# Altium project QuadcopterDesign.PrjPcb (part 4 of 4)
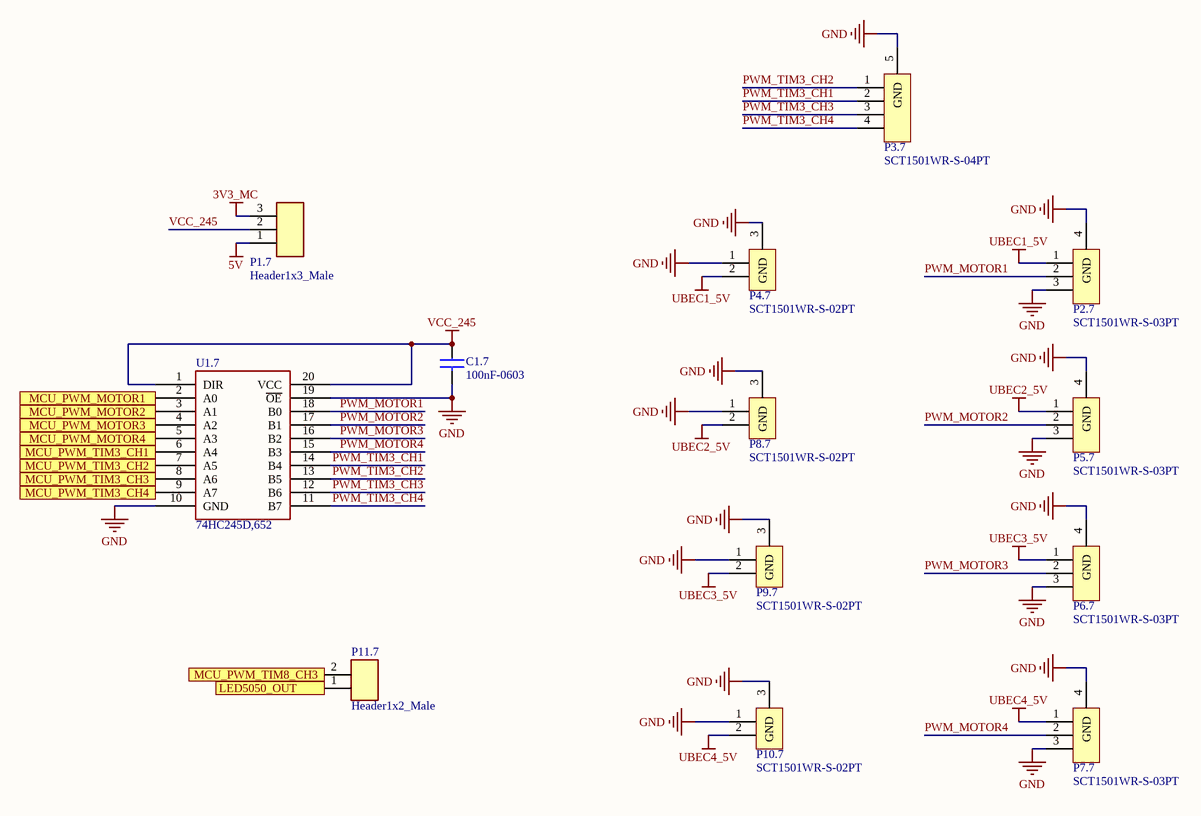
[diagram p7: [7] Motor_Control.SchDoc]

## Nets that join several sheets
3V3_MC: [1] PowerSupply (5 pins), [2] MicroController (17 pins), [7] Motor_Control (P1.7.3)
3V3_Sensor: [1] PowerSupply (C12.1.1 IC5.1.2 IC5.1.4), [3] Sensor (15 pins), [6] Radio Frequency (P4.6.1)
3V3_WIFI: [1] PowerSupply (C3.1.1 IC1.1.2 IC1.1.4), [4] Wifi_ESP32_Antenna (8 pins)
5V: [1] PowerSupply (9 pins), [2] MicroController (B1.2.1), [5] Peripheral_Module (11 pins), [6] Radio Frequency (5 pins), [7] Motor_Control (P1.7.1)
5V_WIFI: [1] PowerSupply (C6.1.1 IC1.1.3 P2.1.1), [4] Wifi_ESP32_Antenna (C4.4.1 C5.4.1 D3.4.1 U2.4.8)
GND: [1] PowerSupply (31 pins), [2] MicroController (27 pins), [3] Sensor (30 pins), [4] Wifi_ESP32_Antenna (24 pins), [5] Peripheral_Module (21 pins), [6] Radio Frequency (28 pins), [7] Motor_Control (20 pins)
MCU_UART4_RX: [2] MicroController (P1.2.1 U1.2.15), [4] Wifi_ESP32_Antenna (S1.4.5)
MCU_UART4_TX: [2] MicroController (P1.2.2 U1.2.14), [4] Wifi_ESP32_Antenna (S1.4.6)
NetD4.5_2: [5] Peripheral_Module (D4.5.2), [7] Motor_Control (P11.7.1)
NetIC1.3_5: [2] MicroController (U1.2.62), [3] Sensor (7 pins)
NetIC1.3_6: [2] MicroController (U1.2.61), [3] Sensor (7 pins)
NetP1.6_2: [2] MicroController (U1.2.51), [6] Radio Frequency (P1.6.2)
NetP1.6_3: [2] MicroController (U1.2.52), [6] Radio Frequency (P1.6.3)
NetP2.5_1: [2] MicroController (U1.2.54), [5] Peripheral_Module (P2.5.1)
NetP2.5_2: [2] MicroController (U1.2.53), [5] Peripheral_Module (P2.5.2)
NetP2.6_1: [2] MicroController (U1.2.21), [5] Peripheral_Module (P5.5.4), [6] Radio Frequency (P2.6.1 RF1.6.12)
NetP2.6_2: [2] MicroController (U1.2.23), [5] Peripheral_Module (P5.5.3), [6] Radio Frequency (P2.6.2 RF1.6.14)
NetP2.6_3: [2] MicroController (U1.2.22), [5] Peripheral_Module (P5.5.2), [6] Radio Frequency (P2.6.3 RF1.6.13)
NetP2.6_4: [2] MicroController (U1.2.25), [6] Radio Frequency (P2.6.4)
NetP3.5_1: [2] MicroController (U1.2.17), [5] Peripheral_Module (P3.5.1)
NetP3.5_2: [2] MicroController (U1.2.16), [5] Peripheral_Module (P3.5.2)
NetP4.5_1: [2] MicroController (U1.2.38), [5] Peripheral_Module (P4.5.1)
NetP4.5_2: [2] MicroController (U1.2.37), [5] Peripheral_Module (P4.5.2)
NetP5.5_1: [2] MicroController (U1.2.20), [5] Peripheral_Module (P5.5.1)
NetP6.3_1: [2] MicroController (U1.2.50), [3] Sensor (P6.3.1 S1.3.1)
NetP6.3_2: [2] MicroController (U1.2.55), [3] Sensor (P6.3.2 S1.3.2)
NetP6.3_3: [2] MicroController (U1.2.29), [3] Sensor (P6.3.3 S1.3.3)
NetP6.3_4: [2] MicroController (U1.2.30), [3] Sensor (P6.3.4 S1.3.4)
NetP6.5_1: [2] MicroController (U1.2.33), [5] Peripheral_Module (P6.5.1)
NetP6.5_2: [2] MicroController (U1.2.34), [5] Peripheral_Module (P6.5.2)
NetP11.7_2: [2] MicroController (U1.2.39), [7] Motor_Control (P11.7.2)
NetR1.5_2: [2] MicroController (U1.2.40), [5] Peripheral_Module (R1.5.2)
NetR2.6_1: [2] MicroController (U1.2.8), [6] Radio Frequency (R2.6.1)
NetRF1.6_4: [2] MicroController (U1.2.45), [6] Radio Frequency (RF1.6.4)
NetRF1.6_15: [2] MicroController (U1.2.24), [6] Radio Frequency (RF1.6.15)
NetU1.2_26: [2] MicroController (U1.2.26), [7] Motor_Control (U1.7.8)
NetU1.2_27: [2] MicroController (U1.2.27), [7] Motor_Control (U1.7.9)
NetU1.2_41: [2] MicroController (U1.2.41), [7] Motor_Control (U1.7.2)
NetU1.2_42: [2] MicroController (U1.2.42), [7] Motor_Control (U1.7.3)
NetU1.2_43: [2] MicroController (U1.2.43), [7] Motor_Control (U1.7.4)
NetU1.2_44: [2] MicroController (U1.2.44), [7] Motor_Control (U1.7.5)
NetU1.2_56: [2] MicroController (U1.2.56), [7] Motor_Control (U1.7.6)
NetU1.2_57: [2] MicroController (U1.2.57), [7] Motor_Control (U1.7.7)